# EAGLE schematic mBot_Schematics (EAGLE 9.7.0)
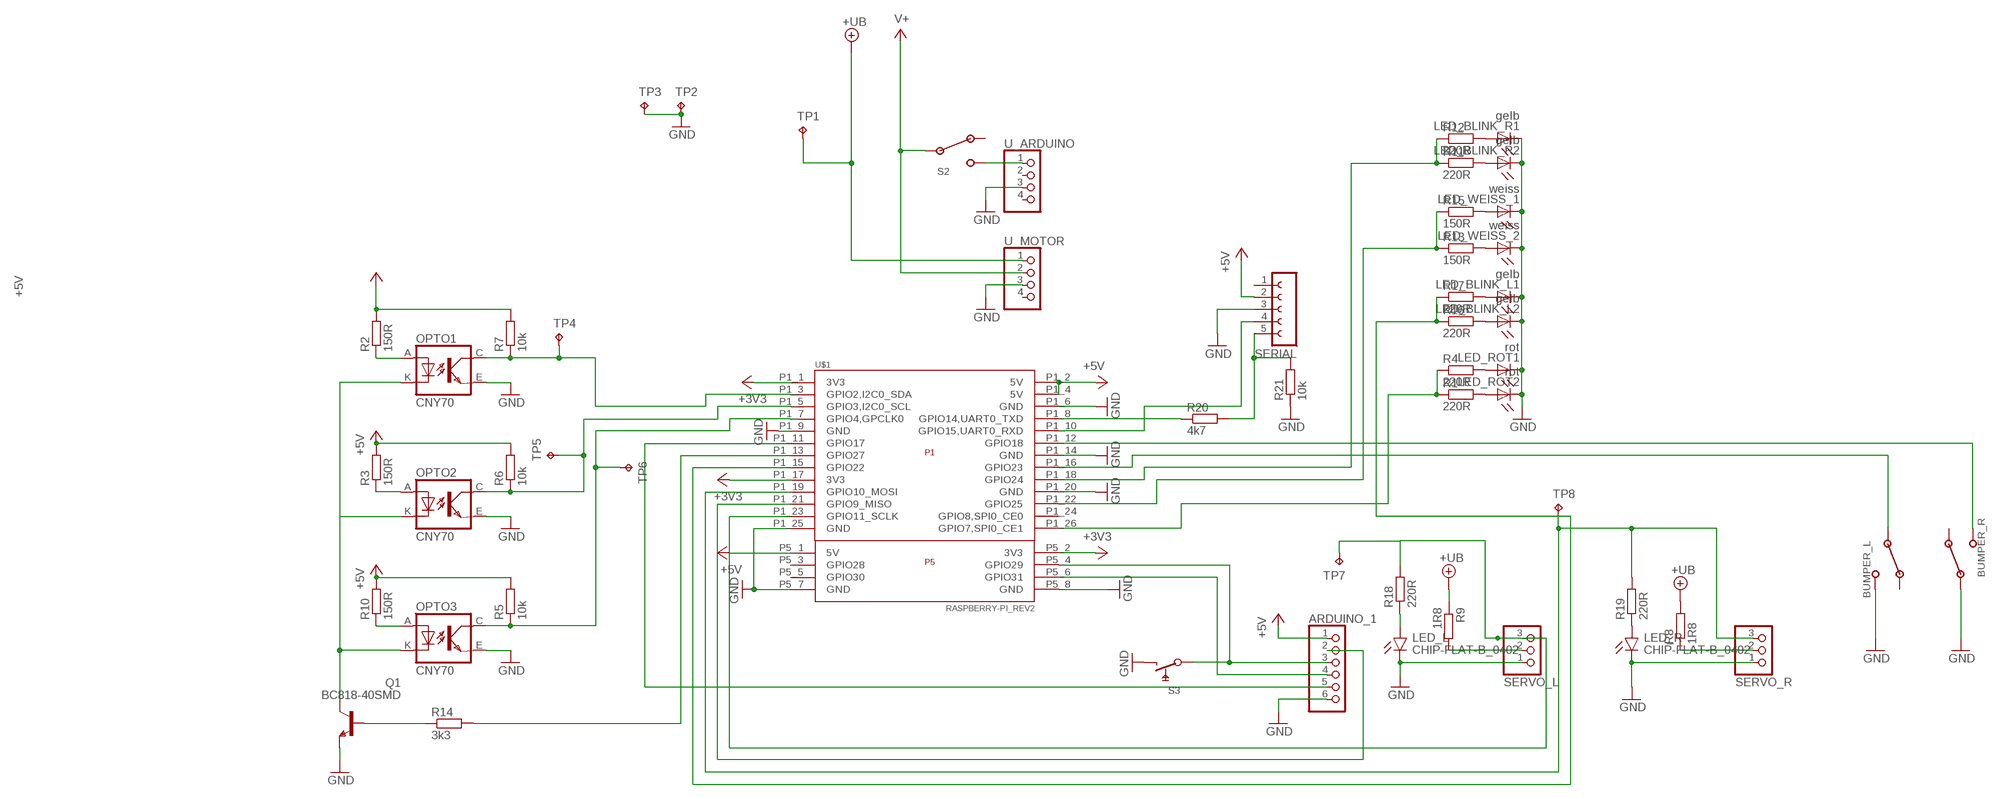
[diagram p0: schematic, sheet 1]

## Parts
ARDUINO_1  PINHD-1X6  [1X06]
BUMPER_L  MINIENDSCHALTERL  [MIKROSCHALTER_H_L]
BUMPER_R  MINIENDSCHALTERL  [MIKROSCHALTER_H_L]
LED_BLINK_L1  gelb  LEDLIEGEND-5MM  [LED5MM-LGD]
LED_BLINK_L2  gelb  LEDLIEGEND-5MM  [LED5MM-LGD]
LED_BLINK_R1  gelb  LEDLIEGEND-5MM  [LED5MM-LGD]
LED_BLINK_R2  gelb  LEDLIEGEND-5MM  [LED5MM-LGD]
LED_L  CHIP-FLAT-B_0402  [LEDC1005X25N_FLAT-B]
LED_R  CHIP-FLAT-B_0402  [LEDC1005X25N_FLAT-B]
LED_ROT1  rot  LEDLIEGEND-5MM  [LED5MM-LGD]
LED_ROT2  rot  LEDLIEGEND-5MM  [LED5MM-LGD]
LED_WEISS_1  weiss  LEDLIEGEND-5MM  [LED5MM-LGD]
LED_WEISS_2  weiss  LEDLIEGEND-5MM  [LED5MM-LGD]
OPTO1  CNY70  [4]
OPTO2  CNY70  [4]
OPTO3  CNY70  [4]
Q1  BC818-40SMD  [SOT23-BEC]
R1  220R  R-EU_M1206  [M1206]
R2  150R  R-EU_M1206  [M1206]
R3  150R  R-EU_R1206  [R1206]
R4  220R  R-EU_M1206  [M1206]
R5  10k  R-EU_M1206  [M1206]
R6  10k  R-EU_M1206  [M1206]
R7  10k  R-EU_M1206  [M1206]
R8  1R8  R-EU_M1206  [M1206]
R9  1R8  R-EU_M1206  [M1206]
R10  150R  R-EU_M1206  [M1206]
R11  220R  R-EU_M1206  [M1206]
R12  220R  R-EU_M1206  [M1206]
R13  150R  R-EU_M1206  [M1206]
R14  3k3  R-EU_M1206  [M1206]
R15  150R  R-EU_M1206  [M1206]
R16  220R  R-EU_M1206  [M1206]
R17  220R  R-EU_M1206  [M1206]
R18  220R  R-EU_M1206  [M1206]
R19  220R  R-EU_M1206  [M1206]
R20  4k7  R-EU_M1206  [M1206]
R21  10k  R-EU_M1206  [M1206]
S2  1XUMA  [1XUM]
S3  MINITAST2  [MINITAST2]
SERIAL  FE05-1  [FE05-1]
SERVO_L  PINHD-1X3  [1X03]
SERVO_R  PINHD-1X3  [1X03]
TP1  TPB2,54  [B2,54]
TP2  TPB2,54  [B2,54]
TP3  TPB2,54  [B2,54]
TP4  TPB2,54  [B2,54]
TP5  TPB2,54  [B2,54]
TP6  TPB2,54  [B2,54]
TP7  TPB2,54  [B2,54]
TP8  TPB2,54  [B2,54]
U$1  RASPBERRY-PI_REV2  [RASPBERRY-PI_REV2]
U_ARDUINO  PINHD-1X4  [1X04]
U_MOTOR  PINHD-1X4  [1X04]

## Nets
+3V3: U$1.P1_1(3V3) U$1.P1_17(3V3) U$1.P5_2(3V3)
+5V: ARDUINO_1.1 R2.2 R3.2 R5.2 R6.2 R7.2 R10.2 SERIAL.2 U$1.P1_2(5V) U$1.P1_4(5V) U$1.P5_1(5V)
+UB: R8.2 R9.1 TP1.TP U_MOTOR.1
GND: ARDUINO_1.6 BUMPER_L.NO(S) LED_BLINK_L1.K(C) LED_BLINK_L2.K(C) LED_BLINK_R1.K(C) LED_BLINK_R2.K(C) LED_L.C LED_R.C LED_ROT1.K(C) LED_ROT2.K(C) LED_WEISS_1.K(C) LED_WEISS_2.K(C) OPTO1.E(EMI) OPTO2.E(EMI) OPTO3.E(EMI) Q1.E R21.1 S3.2 SERIAL.3 SERVO_L.1 SERVO_R.1 TP2.TP TP3.TP U$1.P1_6(GND) U$1.P1_9(GND) U$1.P1_14(GND) U$1.P1_20(GND) U$1.P1_25(GND) U$1.P5_7(GND) U$1.P5_8(GND) U_ARDUINO.3 U_MOTOR.3
N$1: SERIAL.4 U$1.P1_10(GPIO15,UART0_RXD)
N$2: R20.1 U$1.P1_8(GPIO14,UART0_TXD)
N$3: OPTO1.C(COL) R7.1 TP4.TP U$1.P1_3(GPIO2,I2C0_SDA)
N$4: OPTO1.A R2.1
N$5: OPTO2.C(COL) R6.1 TP5.TP U$1.P1_5(GPIO3,I2C0_SCL)
N$6: OPTO3.C(COL) R5.1 TP6.TP U$1.P1_7(GPIO4,GPCLK0)
N$7: OPTO2.A R3.1
N$8: OPTO3.A R10.1
N$9: OPTO1.K(C) OPTO2.K(C) OPTO3.K(C) Q1.C
N$10: Q1.B R14.1
N$11: R14.2 U$1.P1_13(GPIO27)
N$12: R20.2 R21.2 SERIAL.5
N$13: ARDUINO_1.2 U$1.P1_21(GPIO9_MISO)
N$14: ARDUINO_1.3 S3.1 U$1.P5_4(GPIO29)
N$15: ARDUINO_1.4 U$1.P5_6(GPIO31)
N$16: ARDUINO_1.5 U$1.P1_11(GPIO17)
N$17: R18.2 SERVO_L.3 TP7.TP U$1.P1_23(GPIO11_SCLK)
N$18: LED_L.A R18.1
N$19: LED_R.A R19.1
N$20: R9.2 SERVO_L.2
N$21: R19.2 SERVO_R.3 TP8.TP U$1.P1_19(GPIO10_MOSI)
N$22: BUMPER_R.NO(S) U$1.P1_12(GPIO18)
N$23: BUMPER_L.COM(W) U$1.P1_16(GPIO23)
N$24: R8.1 SERVO_R.2
N$25: BUMPER_R.COM(W) ; supply symbol labelled GND
N$26: R11.1 R12.1 U$1.P1_18(GPIO24)
N$27: LED_WEISS_1.A R15.2
N$28: R1.1 R4.1 U$1.P1_26(GPIO7,SPI0_CE1)
N$29: R16.1 R17.1 U$1.P1_15(GPIO22)
N$30: LED_ROT1.A R4.2
N$31: LED_ROT2.A R1.2
N$32: LED_BLINK_L1.A R17.2
N$33: LED_BLINK_L2.A R16.2
N$34: LED_WEISS_2.A R13.2
N$35: R13.1 R15.1 U$1.P1_22(GPIO25)
N$36: LED_BLINK_R2.A R11.2
N$37: LED_BLINK_R1.A R12.2
N$38: S2.2(S) U_ARDUINO.1
V+: S2.W U_MOTOR.2
Unconnected: BUMPER_L.NC(ö) BUMPER_R.NC(ö) S2.1(ö) SERIAL.1 U$1.P1_24(GPIO8,SPI0_CE0) U$1.P5_3(GPIO28) U$1.P5_5(GPIO30) U_ARDUINO.2 U_ARDUINO.4 U_MOTOR.4

## Library data of the parts
ARDUINO_1 = pinhead:PINHD-1X6: PIN HEADER
BUMPER_L BUMPER_R = Schalter_V12:MINIENDSCHALTER
LED_BLINK_L1 LED_BLINK_L2 LED_BLINK_R1 LED_BLINK_R2 LED_ROT1 LED_ROT2 LED_WEISS_1 LED_WEISS_2 = led-2017-03-03:LED: LED OSRAM: - CHIPLED LG R971, LG N971, LY N971, LG Q971, LY Q971, LO R971, LY R971 LH N974, LH R974 LS Q976, LO Q976, LY Q976 LO Q996 - Hyper CHIPLED LW Q18S LB Q993, LB Q99A, LB R99A - SideLED LS A670, LO A670, LY A670, LG A670, LP A670 LB A673, LV A673, LT A673, LW A673 LH A674 LY A675 LS A676, LA A676, LO A676, LY A676, LW A676 LS A679, LY A679, LG A679 - Hyper Micro SIDELED® LS Y876, LA Y876, LO Y876, LY Y876 LT Y87S - SmartLED LW L88C, LW L88S LB L89C, LB L89S, LG L890 LS L89K, LO L89K, LY L89K LS L896, LA L896, LO L896, LY L896 - TOPLED LS T670, LO T670, LY T670, LG T670, LP T670 LSG T670, LSP T670, LSY T670, LOP T670, LYG T670 LG T671, LOG T671, LSG T671 LB T673, LV T673, LT T673, LW T673 LH T674 LS T676, LA T676, LO T676, LY T676, LB T676, LH T676, LSB T676, LW T676 LB T67C, LV T67C, LT T67C, LS T67K, LO T67K, LY T67K, LW E67C LS E67B, LA E67B, LO E67B, LY E67B, LB E67C, LV E67C, LT E67C LW T67C LS T679, LY T679, LG T679 LS T770, LO T770, LY T770, LG T770, LP T770 LB T773, LV T773, LT T773, LW T773 LH T774 LS E675, LA E675, LY E675, LS T675 LS T776, LA T776, LO T776, LY T776, LB T776 LHGB T686 LT T68C, LB T68C - Hyper Mini TOPLED® LB M676 - Mini TOPLED Santana® LG M470 LS M47K, LO M47K, LY M47K Source: http://www.osram.convergy.de LUXEON: - LUMILED® LXK2-PW12-R00, LXK2-PW12-S00, LXK2-PW14-U00, LXK2-PW14-V00 LXK2-PM12-R00, LXK2-PM12-S00, LXK2-PM14-U00 LXK2-PE12-Q00, LXK2-PE12-R00, LXK2-PE12-S00, LXK2-PE14-T00, LXK2-PE14-U00 LXK2-PB12-K00, LXK2-PB12-L00, LXK2-PB12-M00, LXK2-PB14-N00, LXK2-PB14-P00, LXK2-PB14-Q00 LXK2-PR12-L00, LXK2-PR12-M00, LXK2-PR14-Q00, LXK2-PR14-R00 LXK2-PD12-Q00, LXK2-PD12-R00, LXK2-PD12-S00 LXK2-PH12-R00, LXK2-PH12-S00 LXK2-PL12-P00, LXK2-PL12-Q00, LXK2-PL12-R00 Source: www.luxeon.com KINGBRIGHT: KA-3528ASYC Source: www.kingbright.com
LED_L LED_R = LED:CHIP-FLAT-B; CATEGORY: LED; COLOR: BLUE; DESCRIPTION: CHIP LED FLAT; SUB-CATEGORY: CHIP; TYPE: FLAT_TOP
OPTO1-OPTO3 = cny70:CNY70
Q1 = transistor-npn:BC818*: NPN Transistor
R1-R21 = rcl:R-EU_: RESISTOR, European symbol; SPICEPREFIX: R
S2 = Schalter_V12:1XUM
S3 = Schalter_V12:MINITAST
SERIAL = con-lsta:FE05-1: FEMALE HEADER; OC_FARNELL: unknown; OC_NEWARK: unknown
SERVO_L SERVO_R = pinhead:PINHD-1X3: PIN HEADER
TP1-TP8 = testpad:TP: Test pad
U$1 = RaspberryPi:RASPBERRY-PI_REV2: Raspberry Pi Board <http://www.raspberrypi.org/> Jacques Lagnel V1.0 (beta) 2012 Mateusz Bawaj V1.1 (beta) 2012 Board dimension: Forum 3D model <http://www.raspberrypi.org/forum/general-discussion/mechanical-profile-3d-models?value=3d%20model&type=1&include=1&search=1&ret=all> The GPIO Connector (P1): http://elinux.org/RPi_Low-level_peripherals The GPIO Connector (P5): http://www.raspberrypi-spy.co.uk/2012/09/raspberry-pi-p5-header/
U_ARDUINO U_MOTOR = pinhead:PINHD-1X4: PIN HEADER